# Altium project ArduinoUnoSheild.PrjPcb
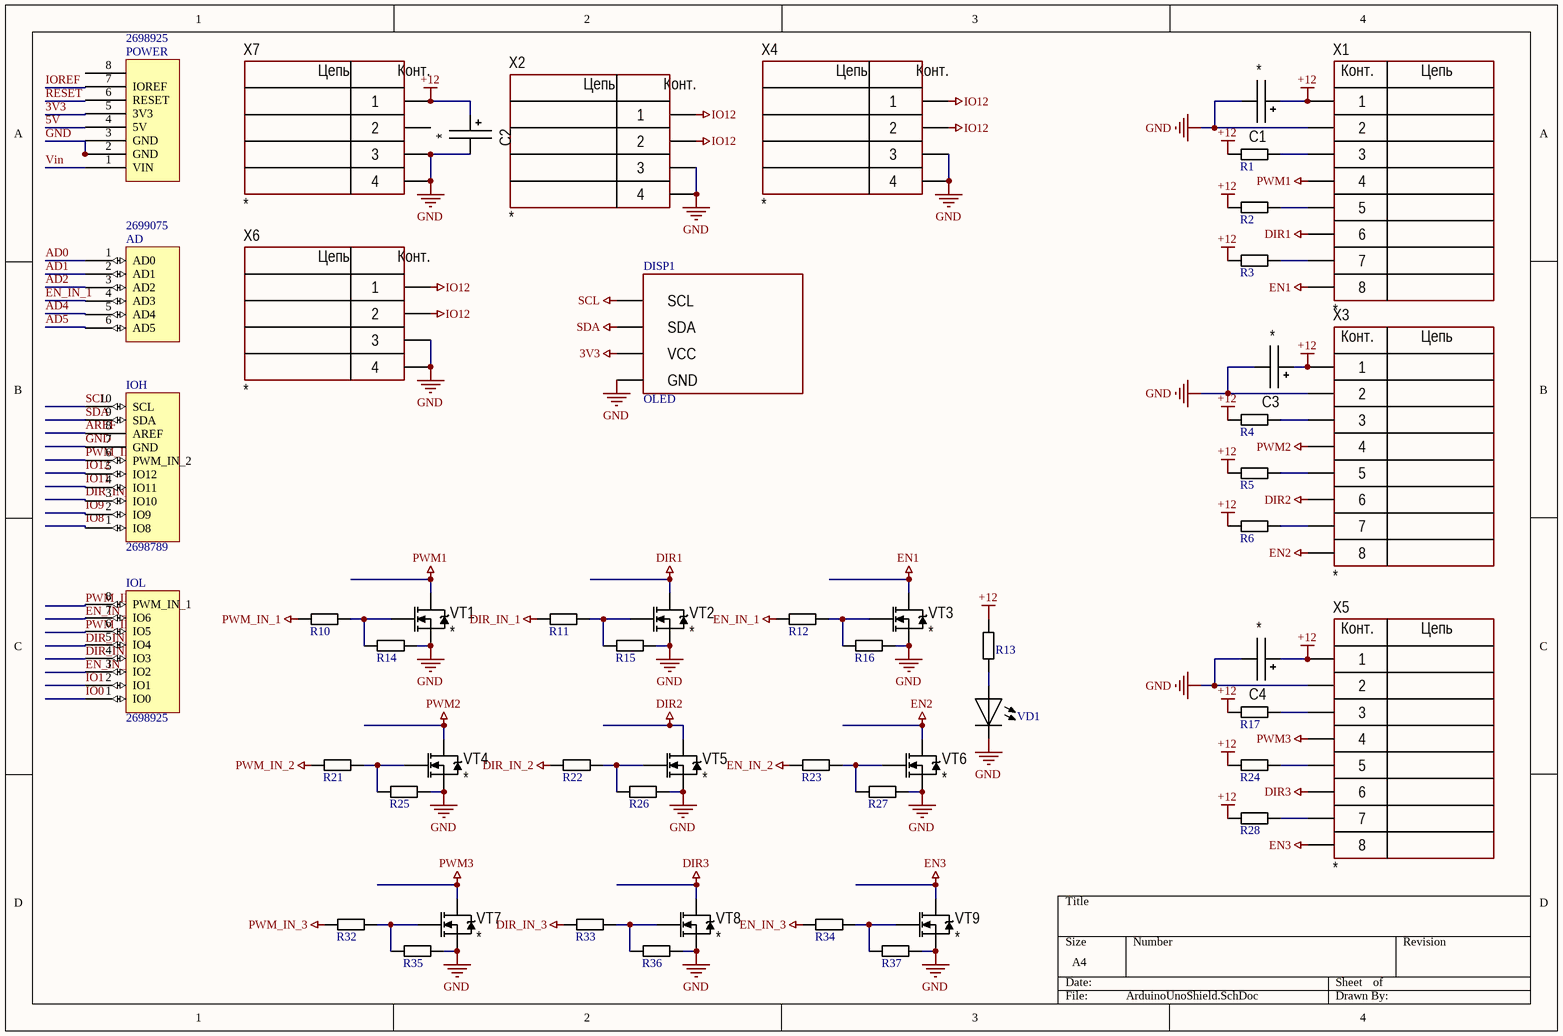
[diagram p0: ArduinoUnoShield.SchDoc]
1 sheet, 54 parts. Net scope: global (net labels, ports and power ports of the same name join across sheets).
Board file: ArduinoUnoShield.PcbDoc

## Sheet ArduinoUnoShield.SchDoc
size A4

### Parts
AD  Supplier Part Number 4: 2699075  [Header 6x1 8.5mm]  (hidden comment: AD)
C1  *  [TANTAL_C]
C2  *  [D10C5H12.5]
C3  *  [TANTAL_C]
C4  *  [TANTAL_C]
DISP1  OLED  [DISP: OPEN_SMART_0.96inch_OLED]
IOH  Supplier Part Number 3: 2698789  [Header 10x1 8.5mm]  (hidden comment: IOH)
IOL  Supplier Part Number 4: 2698925  [Header 8x1 8.5mm]  (hidden comment: IOL)
POWER  Supplier Part Number 4: 2698925  [Header 8x1 8.5mm]  (hidden comment: POWER_UNO)
R1  R_1206_0.25v  [R_1206]  (value not drawn)
R2  R_1206_0.25v  [R_1206]  (value not drawn)
R3  R_1206_0.25v  [R_1206]  (value not drawn)
R4  R_1206_0.25v  [R_1206]  (value not drawn)
R5  R_1206_0.25v  [R_1206]  (value not drawn)
R6  R_1206_0.25v  [R_1206]  (value not drawn)
R10  R_0805_0.125v  [R_0805]  (value not drawn)
R11  R_0805_0.125v  [R_0805]  (value not drawn)
R12  R_0805_0.125v  [R_0805]  (value not drawn)
R13  R_0805_0.125v  [R_0805]  (value not drawn)
R14  R_0805_0.125v  [R_0805]  (value not drawn)
R15  R_0805_0.125v  [R_0805]  (value not drawn)
R16  R_0805_0.125v  [R_0805]  (value not drawn)
R17  R_1206_0.25v  [R_1206]  (value not drawn)
R21  R_0805_0.125v  [R_0805]  (value not drawn)
R22  R_0805_0.125v  [R_0805]  (value not drawn)
R23  R_0805_0.125v  [R_0805]  (value not drawn)
R24  R_1206_0.25v  [R_1206]  (value not drawn)
R25  R_0805_0.125v  [R_0805]  (value not drawn)
R26  R_0805_0.125v  [R_0805]  (value not drawn)
R27  R_0805_0.125v  [R_0805]  (value not drawn)
R28  R_1206_0.25v  [R_1206]  (value not drawn)
R32  R_0805_0.125v  [R_0805]  (value not drawn)
R33  R_0805_0.125v  [R_0805]  (value not drawn)
R34  R_0805_0.125v  [R_0805]  (value not drawn)
R35  R_0805_0.125v  [R_0805]  (value not drawn)
R36  R_0805_0.125v  [R_0805]  (value not drawn)
R37  R_0805_0.125v  [R_0805]  (value not drawn)
VD1  LED  [VD_0603]  (value not drawn)
VT1  *  [SOT23_123]
VT2  *  [SOT23_123]
VT3  *  [SOT23_123]
VT4  *  [SOT23_123]
VT5  *  [SOT23_123]
VT6  *  [SOT23_123]
VT7  *  [SOT23_123]
VT8  *  [SOT23_123]
VT9  *  [SOT23_123]
X1  *  [CON: 0533750810]
X2  *  [CON: 0533750410]
X3  *  [CON: 0533750810]
X4  *  [CON: 0533750410]
X5  *  [CON: 0533750810]
X6  *  [CON: 0533750410]
X7  *  [CON: 0533750410]

### Nets
3V3: DISP1.3(VCC) POWER.5(3V3)
+12: C1.1 C2.1 C3.1 C4.1 R1.1 R2.1 R3.1 R4.1 R5.1 R6.1 R13.2 R17.1 R24.1 R28.1 X1.1 X3.1 X5.1 X7.1
DIR1: VT2.2(D) X1.6
DIR2: VT5.2(D) X3.6
DIR3: VT8.2(D) X5.6
DIR_IN_1: IOL.5(IO4) R11.1
DIR_IN_2: IOL.4(IO3) R22.1
DIR_IN_3: IOH.3(IO10) R33.1
EN1: VT3.2(D) X1.8
EN2: VT6.2(D) X3.8
EN3: VT9.2(D) X5.8
EN_IN_1: AD.4(AD3) R12.1
EN_IN_2: IOL.3(IO2) R23.1
EN_IN_3: IOL.7(IO6) R34.1
GND: C1.2 C2.2 C3.2 C4.2 DISP1.4(GND) POWER.2(GND) R14.2 R15.2 R16.2 R25.2 R26.2 R27.2 R35.2 R36.2 R37.2 VD1.2 VT1.3(S) VT2.3(S) VT3.3(S) VT4.3(S) VT5.3(S) VT6.3(S) VT7.3(S) VT8.3(S) VT9.3(S) X1.2 X2.3 X2.4 X3.2 X4.3 X4.4 X5.2 X6.3 X6.4 X7.3 X7.4
IO12: IOH.5(IO12) X2.1 X2.2 X4.1 X4.2 X6.1 X6.2
PWM1: VT1.2(D) X1.4
PWM2: VT4.2(D) X3.4
PWM3: VT7.2(D) X5.4
PWM_IN_1: IOL.6(IO5) R10.1
PWM_IN_2: IOL.8(PWM_IN_1) R21.1
PWM_IN_3: IOH.6(PWM_IN_2) R32.1
SCL: DISP1.1(SCL) IOH.10(SCL)
SDA: DISP1.2(SDA) IOH.9(SDA)
AD0: AD.1(AD0)
AD1: AD.2(AD1)
AD2: AD.3(AD2)
AD4: AD.5(AD4)
AD5: AD.6(AD5)
IO0: IOL.1(IO0)
IO1: IOL.2(IO1)
IO8: IOH.1(IO8)
IO9: IOH.2(IO9)
IO11: IOH.4(IO11)
Vin: POWER.1(VIN)
NetR1_2: R1.2 X1.3
NetR2_2: R2.2 X1.5
NetR3_2: R3.2 X1.7
NetR4_2: R4.2 X3.3
NetR5_2: R5.2 X3.5
NetR6_2: R6.2 X3.7
NetR10_2: R10.2 R14.1 VT1.1(G)
NetR11_2: R11.2 R15.1 VT2.1(G)
NetR12_2: R12.2 R16.1 VT3.1(G)
NetR13_1: R13.1 VD1.1
NetR17_2: R17.2 X5.3
NetR21_2: R21.2 R25.1 VT4.1(G)
NetR22_2: R22.2 R26.1 VT5.1(G)
NetR23_2: R23.2 R27.1 VT6.1(G)
NetR24_2: R24.2 X5.5
NetR28_2: R28.2 X5.7
NetR32_2: R32.2 R35.1 VT7.1(G)
NetR33_2: R33.2 R36.1 VT8.1(G)
NetR34_2: R34.2 R37.1 VT9.1(G)

Not connected (* = marked no-connect by the designer): IOH 7(GND) 8(AREF); POWER 3(GND) 4(5V) 6(RESET) 7(IOREF) 8; X7 2

### Notes on the sheet
- (in symbol 4-Connector) Цепь; Конт.
- (in symbol 8-Connector) Конт.; Цепь

### Library data of the parts
C1 C3 C4 = TantalCap: Manufacturer: *; Model: *; HelpURL: *; ComponentKind: *; Value: *
C2 = AlumCap: Manufacturer: *; Model: *; HelpURL: *; ComponentKind: *; Value: *
DISP1 = OLED_SSD13
VT1-VT9 = N-chanel: Mosfet; Model: *; Manufacturer: *; ComponentKind: *; HelpURL: *
X1 X3 X5 = 8-Connector: Model: *; Manufacturer: *; HelpURL: *; ComponentKind: *
X2 X4 X6 X7 = 4-Connector: Model: *; Manufacturer: *; HelpURL: *; ComponentKind: *
AD = AD: Supplier 1: Arrow; Supplier Part Number 1: 2699089; Supplier 2: Digi-Key; Supplier Part Number 2: SAM1198-06-ND; Supplier 3: Arrow; Supplier Part Number 3: 2699088; Supplier 4: Arrow
IOH = IOH: Supplier 1: Arrow; Supplier Part Number 1: 2698803S4475693N1004; Supplier 2: Digi-Key; Supplier Part Number 2: SAM1198-10-ND; Supplier 3: Arrow
IOL = IOL: Supplier 1: Digi-Key; Supplier Part Number 1: SAM1198-08-ND; Supplier 2: Arrow; Supplier Part Number 2: 2698939; Supplier 3: Arrow; Supplier Part Number 3: 2698940; Supplier 4: Arrow
POWER = POWER_UNO: Supplier 1: Digi-Key; Supplier Part Number 1: SAM1198-08-ND; Supplier 2: Arrow; Supplier Part Number 2: 2698939; Supplier 3: Arrow; Supplier Part Number 3: 2698940; Supplier 4: Arrow